# EAGLE schematic main (EAGLE 9.5.2)
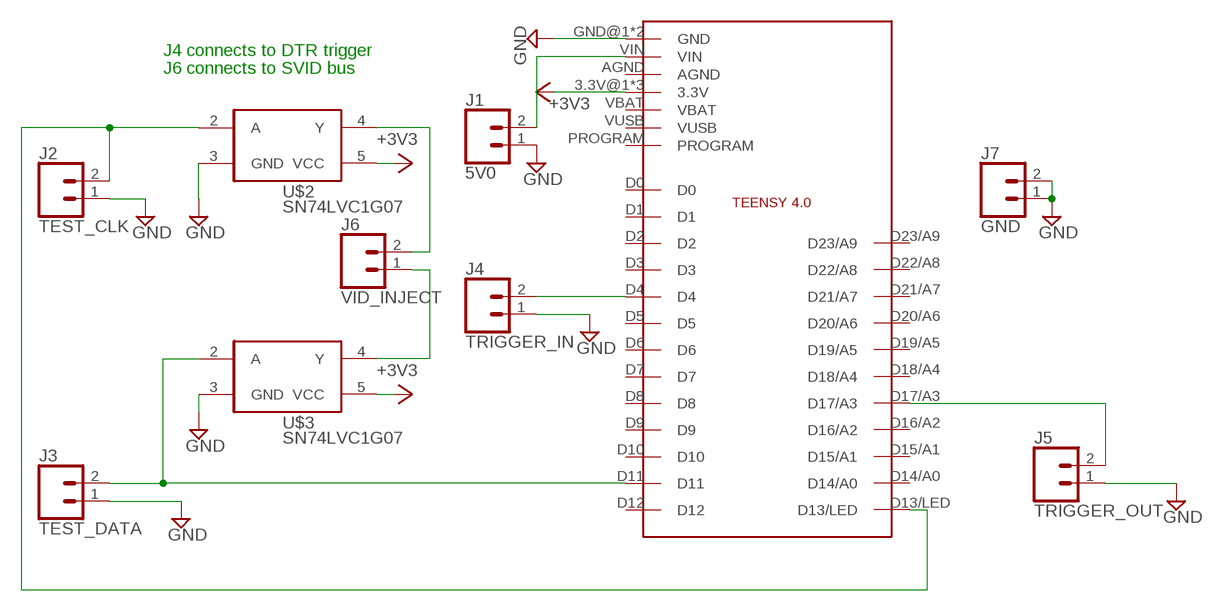
[diagram p0: schematic, sheet 1]

## Parts
J1  5V0  CONN_02  [1X02]
J2  TEST_CLK  CONN_02  [1X02]
J3  TEST_DATA  CONN_02  [1X02]
J4  TRIGGER_IN  CONN_02  [1X02]
J5  TRIGGER_OUT  CONN_02  [1X02]
J6  VID_INJECT  CONN_02  [1X02]
J7  GND  CONN_02  [1X02]
U$1  TEENSY4.0  [TEENSY4.0]
U$2  SN74LVC1G07  [SOT353-1]
U$3  SN74LVC1G07  [SOT353-1]

## Nets
+3V3: U$1.3.3V@1(3.3V) U$1.3.3V@2(3.3V) U$1.ON/OFF(3.3V) U$2.5(VCC) U$3.5(VCC)
GND: J1.1 J2.1 J3.1 J4.1 J5.1 J7.1 J7.2 U$1.GND@1(GND) U$1.GND@2(GND) U$2.3(GND) U$3.3(GND)
N$1: J4.2 U$1.D4
N$2: J3.2 U$1.D11 U$3.2(A)
N$3: J1.2 U$1.VIN
N$4: J6.1 U$3.4(Y)
N$5: J6.2 U$2.4(Y)
N$6: J5.2 U$1.D17/A3
N_CLK: J2.2 U$1.D13/LED U$2.2(A)
Unconnected: U$1.AGND U$1.D0 U$1.D1 U$1.D2 U$1.D3 U$1.D5 U$1.D6 U$1.D7 U$1.D8 U$1.D9 U$1.D10 U$1.D12 U$1.D14/A0 U$1.D15/A1 U$1.D16/A2 U$1.D18/A4 U$1.D19/A5 U$1.D20/A6 U$1.D21/A7 U$1.D22/A8 U$1.D23/A9 U$1.PROGRAM U$1.VBAT U$1.VUSB

## Notes on the sheet
- J4 connects to DTR trigger
- J6 connects to SVID bus

## Library data of the parts
J1-J7 = SparkFun-Connectors:CONN_02: Multi connection point. Often used as Generic Header-pin footprint for 0.1 inch spaced/style header connections On any of the 0.1 inch spaced packages, you can populate with these: Break Away Headers - Straight <https://www.sparkfun.com/products/116> (PRT-00116) Break Away Male Headers - Right Angle <https://www.sparkfun.com/products/553> (PRT-00553) Female Headers <https://www.sparkfun.com/products/115> (PRT-00115) Break Away Headers - Machine Pin <https://www.sparkfun.com/products/117> (PRT-00117) Break Away Female Headers - Swiss Machine Pin <https://www.sparkfun.com/products/743> (PRT-00743) For SCREWTERMINALS and SPRING TERMINALS visit here: Screw Terimnals on SparkFun.com <https://www.sparkfun.com/search/results?term=Screw+Terminals> (5mm/3.5mm/2.54mm spacing) This device is also useful as a general connection point to wire up your design to another part of your project. Our various solder wires solder well into these plated through hole pads. Hook-Up Wire - Assortment (Stranded, 22 AWG) <https://www.sparkfun.com/products/11375> (PRT-11375) Hook-Up Wire - Assortment (Solid Core, 22 AWG) <https://www.sparkfun.com/products/11367> (PRT-11367) View the entire wire category on our website here <https://www.sparkfun.com/categories/141> Special notes: Molex polarized connector foot print use with: PRT-08233 with associated crimp pins and housings. 2.54_SCREWTERM for use with PRT-10571. 3.5mm Screw Terminal footprints for PRT-08084 5mm Screw Terminal footprints for use with PRT-08432
U$1 = Teensy4.0:TEENSY4.0
U$2 U$3 = lib:SN74LVC1G07